# EAGLE design OTArdunioY2 (EAGLE 6.5.0)
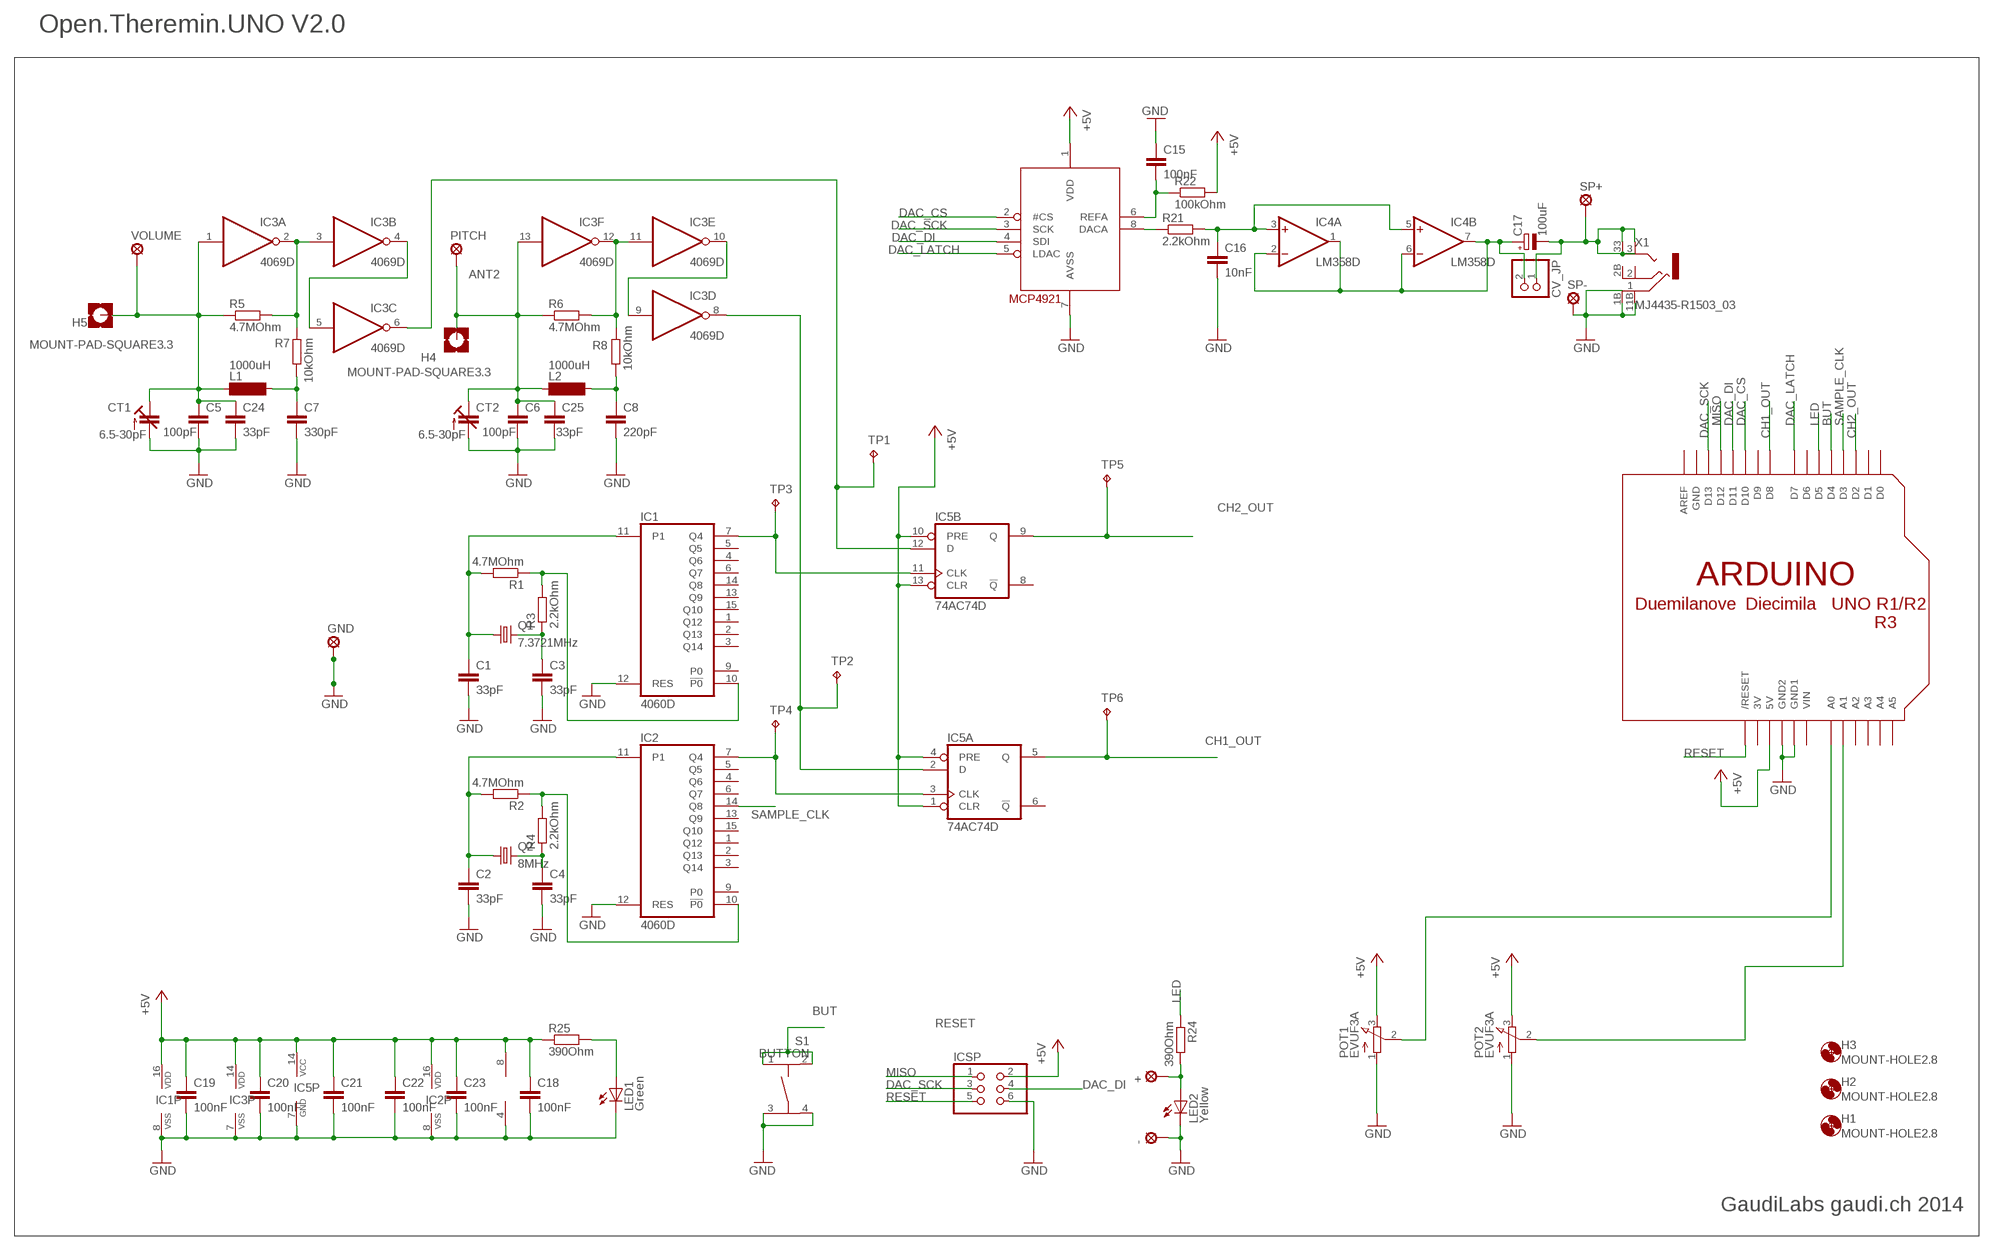
[diagram p0: schematic, sheet 1]

## Parts
+  LSP11  [LSP11]
-  LSP11  [LSP11]
C1  33pF  C-EUC0805  [C0805]
C2  33pF  C-EUC0805  [C0805]
C3  33pF  C-EUC0805  [C0805]
C4  33pF  C-EUC0805  [C0805]
C5  100pF  C-EUC0805  [C0805]
C6  100pF  C-EUC0805  [C0805]
C7  330pF  C-EUC0805  [C0805]
C8  220pF  C-EUC0805  [C0805]
C15  100nF  C-EUC0805  [C0805]
C16  10nF  C-EUC0805  [C0805]
C17  100uF  CPOL-EU153CLV-0505  [153CLV-0505]
C18  100nF  C-EUC0805  [C0805]
C19  100nF  C-EUC0805  [C0805]
C20  100nF  C-EUC0805  [C0805]
C21  100nF  C-EUC0805  [C0805]
C22  100nF  C-EUC0805  [C0805]
C23  100nF  C-EUC0805  [C0805]
C24  33pF  C-EUC0805  [C0805]
C25  33pF  C-EUC0805  [C0805]
CT1  6.5-30pF  C-TRIMMTZBX4  [CTRIMTZBX4]
CT2  6.5-30pF  C-TRIMMTZBX4  [CTRIMTZBX4]
CV_JP  PINHD-1X2  [1X02]
GND  SE14  [SE14]
H1  MOUNT-HOLE2.8  MOUNT-HOLE3.3  [3,3]
H2  MOUNT-HOLE2.8  MOUNT-HOLE3.3  [3,3]
H3  MOUNT-HOLE2.8  MOUNT-HOLE3.3  [3,3]
H4  MOUNT-PAD-SQUARE3.3  [3,3-PAD-SQUARE]
H5  MOUNT-PAD-SQUARE3.3  [3,3-PAD-SQUARE]
IC1  4060D  [SO16]
IC2  4060D  [SO16]
IC3  4069D  [SO14]
IC4  LM358D  [SO08]
IC5  74AC74D  [SO14]
IC6  MCP4921SO8  [SO08]
ICSP  PINHD-2X3  [2X03]
L1  1000uH  MS42  [MS42]
L2  1000uH  MS42  [MS42]
LED1  Green  LEDCHIPLED_0805  [CHIPLED_0805]
LED2  Yellow  LEDCHIPLED_0805  [CHIPLED_0805]
PITCH  SE14  [SE14]
POT1  EVUF3A  [EVUF]
POT2  EVUF3A  [EVUF]
Q1  7.3721MHz  CSM-7X-DU  [CSM-7X-DU]
Q2  8MHz  CSM-7X-DU  [CSM-7X-DU]
R1  4.7MOhm  R-EU_M0805  [M0805]
R2  4.7MOhm  R-EU_M0805  [M0805]
R3  2.2kOhm  R-EU_M0805  [M0805]
R4  2.2kOhm  R-EU_M0805  [M0805]
R5  4.7MOhm  R-EU_M0805  [M0805]
R6  4.7MOhm  R-EU_M0805  [M0805]
R7  10kOhm  R-EU_M0805  [M0805]
R8  10kOhm  R-EU_M0805  [M0805]
R21  2.2kOhm  R-EU_M0805  [M0805]
R22  100kOhm  R-EU_M0805  [M0805]
R24  390Ohm  R-EU_M0805  [M0805]
R25  390Ohm  R-EU_M0805  [M0805]
S1  BUTTON  TASTER-9314_SMD  [TASTER-9314_SMD]
SP+  LSP11  [LSP11]
SP-  LSP11  [LSP11]
TP1  TPTP15R  [TP15R]
TP2  TPTP15R  [TP15R]
TP3  TPTP15R  [TP15R]
TP4  TPTP15R  [TP15R]
TP5  TPTP15R  [TP15R]
TP6  TPTP15R  [TP15R]
U$1  ARDUINODUEMILANOVE-NODIM  ARDUINO-NODIM  [ARDUINO-NODIM]
VOLUME  SE14  [SE14]
X1  MJ4435-R1503_03  [1503_02]

## Nets
+5V: C18.1 C19.1 C20.1 C21.1 C22.1 C23.1 IC1.16(VDD) IC2.16(VDD) IC3.14(P:VDD) IC4.8(P:V+) IC5.1(A:CLR) IC5.4(A:PRE) IC5.10(B:PRE) IC5.13(B:CLR) IC5.14(P:VCC) IC6.1(VDD) ICSP.2 POT1.3(E) POT2.3(E) R22.2 R25.1 U$1.5V
ANT2: C6.1 C25.1 CT2.1(E) H4.B3,3(MOUNT) IC3.13(F:I) L2.1 PITCH.MP R6.1
BUT: S1.1 S1.2 U$1.D4
CH1_OUT: IC5.5(A:Q) TP6.TP U$1.D8
CH2_OUT: IC5.9(B:Q) TP5.TP U$1.D2
DAC_CS: IC6.2(#CS) U$1.D10
DAC_DI: IC6.4(SDI) ICSP.4 U$1.D11
DAC_LATCH: IC6.5(LDAC) U$1.D7
DAC_SCK: IC6.3(SCK) ICSP.3 U$1.D13
GND: -.MP C1.2 C2.2 C3.2 C4.2 C5.2 C6.2 C7.2 C8.2 C15.1 C16.2 C18.2 C19.2 C20.2 C21.2 C22.2 C23.2 C24.2 C25.2 CT1.2(A) CT2.2(A) GND.MP IC1.8(VSS) IC1.12(RES) IC2.8(VSS) IC2.12(RES) IC3.7(P:VSS) IC4.4(P:V-) IC5.7(P:GND) IC6.7(AVSS) ICSP.6 LED1.C LED2.C POT1.1(A) POT2.1(A) S1.3 S1.4 SP-.MP U$1.GND1 U$1.GND2 X1.1(1_1) X1.1B(1_3) X1.11B(1_4)
LED: R24.1 U$1.D5
MISO: ICSP.1 U$1.D12
N$1: C1.1 IC1.11(P1) Q1.1 R1.2
N$2: C17.- CV_JP.1 SP+.MP X1.3(3_1) X1.3B(3_2) X1.33(3_3) X1.33B(3_4)
N$3: IC1.10(!P0) R1.1 R3.2
N$4: POT2.2(S) U$1.A1
N$5: +.MP LED2.A R24.2
N$6: C3.1 Q1.2 R3.1
N$7: C2.1 IC2.11(P1) Q2.1 R2.2
N$8: LED1.A R25.2
N$9: C4.1 Q2.2 R4.1
N$10: IC2.10(!P0) R2.1 R4.2
N$11: C5.1 C24.1 CT1.1(E) H5.B3,3(MOUNT) IC3.1(A:I) L1.1 R5.1 VOLUME.MP
N$12: IC3.6(C:O) IC5.12(B:D) TP1.TP
N$13: C7.1 L1.2 R7.1
N$14: POT1.2(S) U$1.A0
N$16: C17.+ CV_JP.2 IC4.1(A:OUT) IC4.2(A:-IN) IC4.6(B:-IN) IC4.7(B:OUT)
N$17: IC3.8(D:O) IC5.2(A:D) TP2.TP
N$18: C8.1 L2.2 R8.1
N$21: IC1.7(Q4) IC5.11(B:CLK) TP3.TP
N$23: IC2.7(Q4) IC5.3(A:CLK) TP4.TP
N$35: C15.2 IC6.6(REFA) R22.1
N$36: IC6.8(DACA) R21.1
N$37: IC3.11(E:I) IC3.12(F:O) R6.2 R8.2
N$38: IC3.2(A:O) IC3.3(B:I) R5.2 R7.2
N$39: IC3.4(B:O) IC3.5(C:I)
N$40: C16.1 IC4.3(A:+IN) IC4.5(B:+IN) R21.2
N$42: IC3.9(D:I) IC3.10(E:O)
RESET: ICSP.5 U$1.RESET(/RESET)
SAMPLE_CLK: IC2.14(Q8) U$1.D3
Unconnected: IC1.1(Q12) IC1.2(Q13) IC1.3(Q14) IC1.4(Q6) IC1.5(Q5) IC1.6(Q7) IC1.9(P0) IC1.13(Q9) IC1.14(Q8) IC1.15(Q10) IC2.1(Q12) IC2.2(Q13) IC2.3(Q14) IC2.4(Q6) IC2.5(Q5) IC2.6(Q7) IC2.9(P0) IC2.13(Q9) IC2.15(Q10) IC5.6(A:!Q) IC5.8(B:!Q) U$1.A2 U$1.A3 U$1.A4 U$1.A5 U$1.AREF U$1.D0 U$1.D1 U$1.D6 U$1.D9 X1.2(2_1) X1.2B(2_3) X1.11(1_2) X1.22(2_2) X1.22B(2_4)

## Notes on the sheet
- Open.Theremin.UNO V2.0
- RESET
- GaudiLabs gaudi.ch 2014

## Power pins joined to a net without a drawn wire
3V: U$1.3V
GND: U$1.GND
VIN: U$1.VIN

## Library data of the parts
+ - SP+ SP- = solpad:LSP11: SOLDER PAD drill 1.1 mm
C1-C8 C15 C16 C24 C25 = resistor:C-EU: CAPACITOR, European symbol
C17 = resistor:CPOL-EU: POLARIZED CAPACITOR, European symbol
C18-C23 = rcl:C-EU: CAPACITOR, European symbol
CT1 CT2 = resistor:C-TRIMM: Trimm capacitor
CV_JP = pinhead:PINHD-1X2: PIN HEADER
GND PITCH VOLUME = solpad:SE14: SOLDER PAD E1553, drill 1,4mm, distributor Buerklin, 07F820
H1-H3 = holes:MOUNT-HOLE: MOUNTING HOLE with drill center marker
H4 H5 = Gaudi:MOUNT-PAD-SQUARE: MOUNTING PAD, square
IC1 IC2 = Gaudi:4060: 14-stage binary/ripple COUNTER
IC3 = Gaudi:4069: Hex INVERTER
IC4 = Gaudi:LM358: OP AMP also LM158; LM258; LM2904 Source: http://cache.national.com/ds/LM/LM158.pdf
IC5 = 74xx-eu:74*74: Dual D type positive edge triggered FLIP FLOP, preset and clear
IC6 = Gaudi:MCP4921
ICSP = pinhead:PINHD-2X3: PIN HEADER
L1 L2 = Gaudi:MS42: INDUCTOR SMD inductor; OC_FARNELL: unknown; OC_NEWARK: unknown
LED1 LED2 = led:LED: LED OSRAM: - CHIPLED LG R971, LG N971, LY N971, LG Q971, LY Q971, LO R971, LY R971 LH N974, LH R974 LS Q976, LO Q976, LY Q976 LO Q996 - Hyper CHIPLED LW Q18S LB Q993, LB Q99A, LB R99A - SideLED LS A670, LO A670, LY A670, LG A670, LP A670 LB A673, LV A673, LT A673, LW A673 LH A674 LY A675 LS A676, LA A676, LO A676, LY A676, LW A676 LS A679, LY A679, LG A679 - Hyper Micro SIDELED® LS Y876, LA Y876, LO Y876, LY Y876 LT Y87S - SmartLED LW L88C, LW L88S LB L89C, LB L89S, LG L890 LS L89K, LO L89K, LY L89K LS L896, LA L896, LO L896, LY L896 - TOPLED LS T670, LO T670, LY T670, LG T670, LP T670 LSG T670, LSP T670, LSY T670, LOP T670, LYG T670 LG T671, LOG T671, LSG T671 LB T673, LV T673, LT T673, LW T673 LH T674 LS T676, LA T676, LO T676, LY T676, LB T676, LH T676, LSB T676, LW T676 LB T67C, LV T67C, LT T67C, LS T67K, LO T67K, LY T67K, LW E67C LS E67B, LA E67B, LO E67B, LY E67B, LB E67C, LV E67C, LT E67C LW T67C LS T679, LY T679, LG T679 LS T770, LO T770, LY T770, LG T770, LP T770 LB T773, LV T773, LT T773, LW T773 LH T774 LS E675, LA E675, LY E675, LS T675 LS T776, LA T776, LO T776, LY T776, LB T776 LHGB T686 LT T68C, LB T68C - Hyper Mini TOPLED® LB M676 - Mini TOPLED Santana® LG M470 LS M47K, LO M47K, LY M47K Source: http://www.osram.convergy.de LUXEON: - LUMILED® LXK2-PW12-R00, LXK2-PW12-S00, LXK2-PW14-U00, LXK2-PW14-V00 LXK2-PM12-R00, LXK2-PM12-S00, LXK2-PM14-U00 LXK2-PE12-Q00, LXK2-PE12-R00, LXK2-PE12-S00, LXK2-PE14-T00, LXK2-PE14-U00 LXK2-PB12-K00, LXK2-PB12-L00, LXK2-PB12-M00, LXK2-PB14-N00, LXK2-PB14-P00, LXK2-PB14-Q00 LXK2-PR12-L00, LXK2-PR12-M00, LXK2-PR14-Q00, LXK2-PR14-R00 LXK2-PD12-Q00, LXK2-PD12-R00, LXK2-PD12-S00 LXK2-PH12-R00, LXK2-PH12-S00 LXK2-PL12-P00, LXK2-PL12-Q00, LXK2-PL12-R00 Source: www.luxeon.com KINGBRIGHT: KA-3528ASYC Source: www.kingbright.com
POT1 POT2 = Gaudi:EVU: 9 mm Square Rotary Potentiometers Source: Panasonic
Q1 Q2 = Gaudi:CSM-7X-DU: SMD CRYSTAL Source: www.ecsxtal.com .. Crystal 3.6864MHz CSM_7X_DU.PDF; OC_FARNELL: unknown; OC_NEWARK: unknown
R1-R8 R21 R22 R24 R25 = resistor:R-EU_: RESISTOR, European symbol
S1 = Gaudi:TASTER-9314_SMD
TP1-TP6 = testpad:TP: Test pad
U$1 = Gaudi:ARDUINO: Arduino Diecimila/Duemilanove Make a shield with ease, this package has all the named pins as well as the two mounting drill holes and an outline of the USB and DC power connector. The outline is on the DIMENSION layer, so if your board house uses it they will cut the outline to match. http://www.ladyada.net/library/pcb/eaglelibrary.html
X1 = Gaudi:MJ4435-R: Jack connectors according to JISC 6560, 3.5 mm Klinkeneinbaukupplung nach JISC 6560, 3,5 mm, 3-polig/stereo, abgewinkelte Ausführung, Surface-Mount-Technik (SMT) Source: http://www.lumberg.com/Produkte/PDFs/1503_02.pdf

## Board
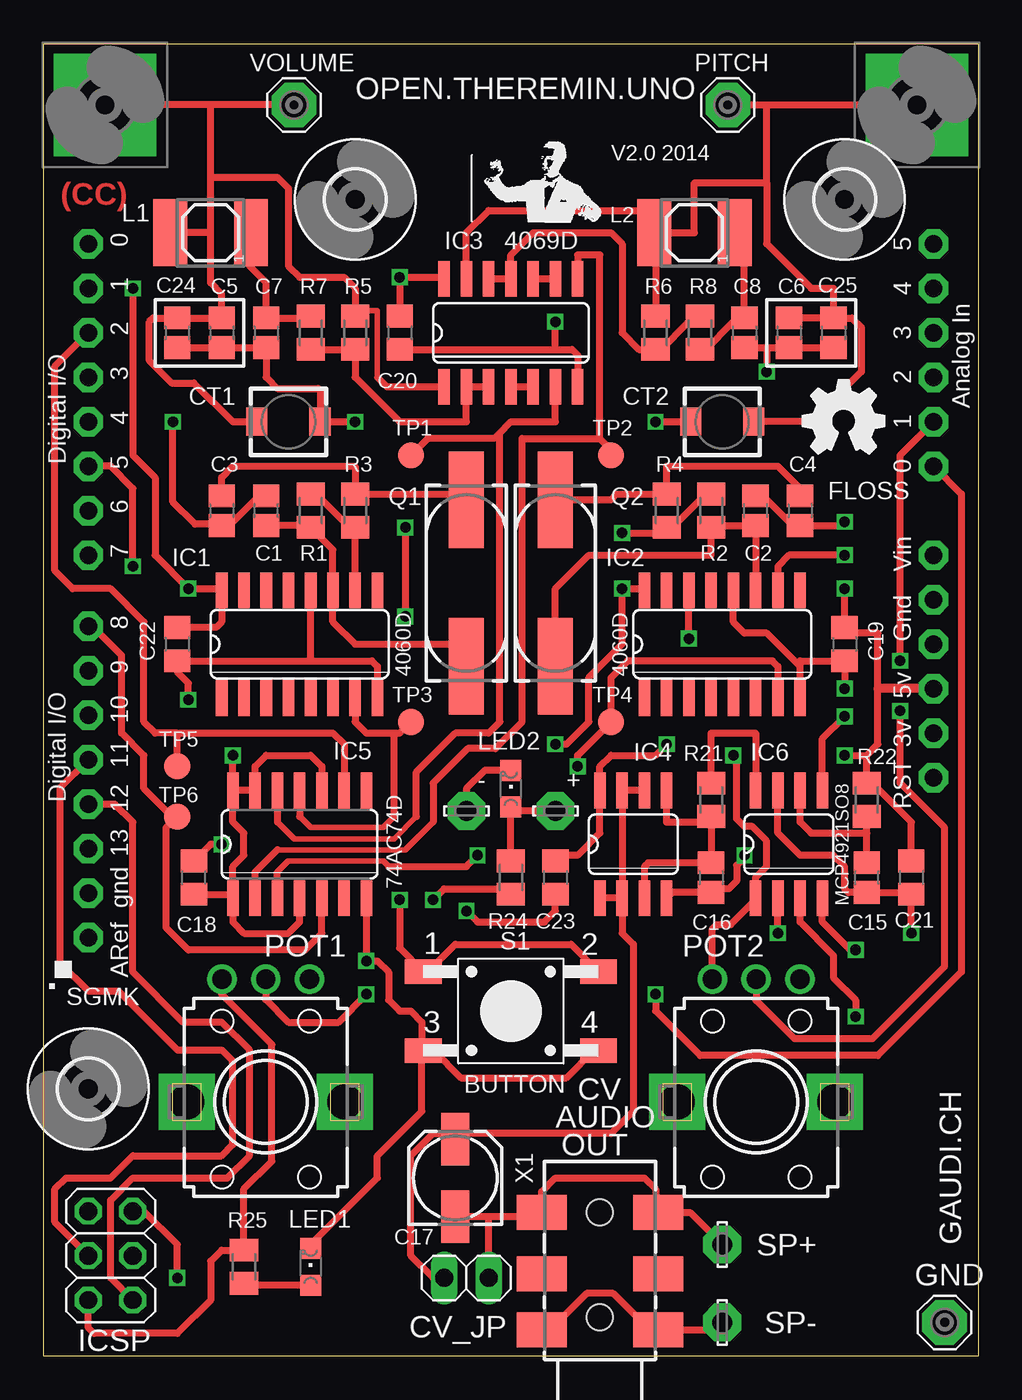
[diagram p1: board, top side]
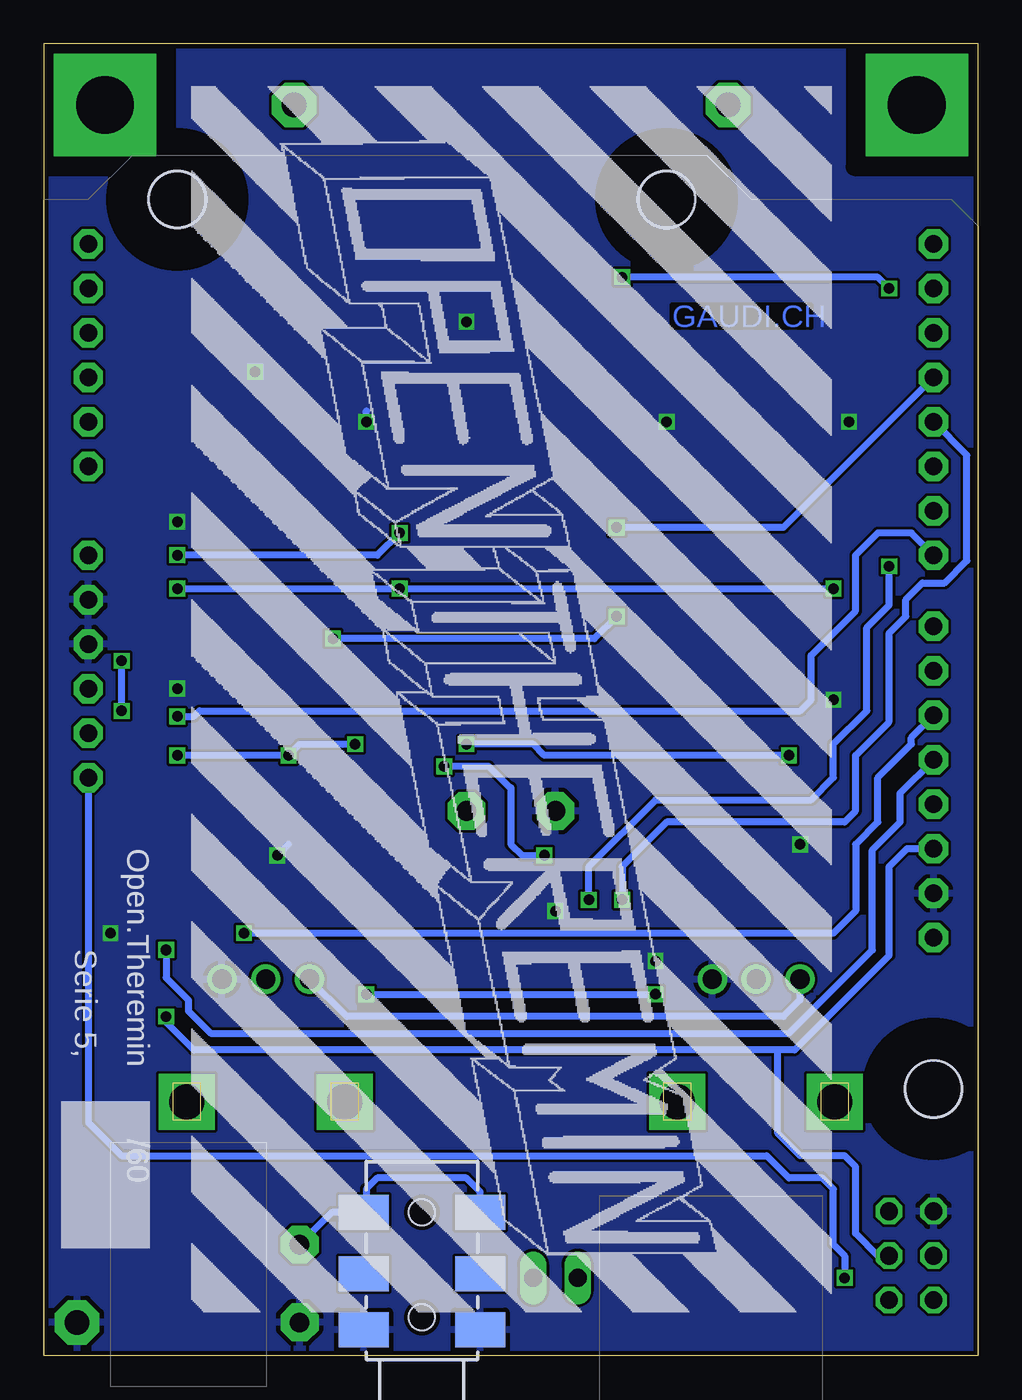
[diagram p2: board, bottom side, seen from below]

Size 53.34 x 74.93 mm. Coordinates in mm from the lower left corner, seen from the top.
Outline: 53.34,74.93 53.34,0 0,0 0,74.93 53.34,74.93
Copper layers (1*2*15*16): Top 0.035mm / dielectric 0.2mm / Route2 0.0175mm / dielectric 1.1mm / Route15 0.0175mm / dielectric 0.2mm / Bottom 0.035mm
Design rules "SeeedStudio_DRU_no_angle_20130527 *": minimum track width 6mil, minimum drill 12mil, track to track 6mil, track to pad 6mil, pad to pad 6mil, via to via 6mil, smd to smd 0mil, copper to edge 10mil, drill to drill 10mil, minimum pad ring 6mil, minimum via ring 6mil, stop-mask expansion 2mil, vias tented up to drill 25mil, thermal gap 10mil

### Footprints (pad centres in the part's own frame; a part is rotated, then mirrored left to right if it is on the bottom)
LSP11 = drill 1.118 pad 2.159 octagon: MP 0,0
C0805 = smd 1.3 x 1.5: 1 -0.85,0; 2 0.85,0
153CLV-0505 = smd 3 x 1.6: + 2.2,0; - -2.2,0
C0805' = smd 1.3 x 1.5: 1 -0.95,0; 2 0.95,0
CTRIMTZBX4 = smd 1.6 x 1.2: 1 0,1.8; 2 0,-1.8
1X02 = drill 1.016 long: 1 -1.27,0; 2 1.27,0
SE14 = drill 1.397 pad 2.54 octagon: MP 0,0
3,3 = hole 3.3: 0,0
3,3-PAD-SQUARE = drill 3.3 pad 5.842 square: B3,3 0,0
SO16 = smd 0.66 x 2.032: 1 -4.445,-3.073; 2 -3.175,-3.073; 3 -1.905,-3.073; 4 -0.635,-3.073; 5 0.635,-3.073; 6 1.905,-3.073; 7 3.175,-3.073; 8 4.445,-3.073; 9 4.445,3.073; 10 3.175,3.073; 11 1.905,3.073; 12 0.635,3.073; 13 -0.635,3.073; 14 -1.905,3.073; 15 -3.175,3.073; 16 -4.445,3.073
SO14 = smd 0.66 x 2.032: 1 -3.81,-3.073; 2 -2.54,-3.073; 3 -1.27,-3.073; 4 0,-3.073; 5 1.27,-3.073; 6 2.54,-3.073; 7 3.81,-3.073; 8 3.81,3.073; 9 2.54,3.073; 10 1.27,3.073; 11 0,3.073; 12 -1.27,3.073; 13 -2.54,3.073; 14 -3.81,3.073
SO08 = smd 0.66 x 2.032: 1 -1.905,-3.073; 2 -0.635,-3.073; 3 0.635,-3.073; 4 1.905,-3.073; 5 1.905,3.073; 6 0.635,3.073; 7 -0.635,3.073; 8 -1.905,3.073
2X03 = drill 1.016 octagon: 1 -2.54,-1.27; 2 -2.54,1.27; 3 0,-1.27; 4 0,1.27; 5 2.54,-1.27; 6 2.54,1.27
MS42 = smd 3.81 x 1.93: 1 0,2.3; 2 0,-2.3
CHIPLED_0805 = smd 1.2 x 1.2: A 0,-1.05; C 0,1.05
EVUF = drill 1.1 pad 1.676: 1 -2.5,-7; 2 0,-7; 3 2.5,-7 | drill 2 pad 3.2 square: M1 4.5,0; M2 -4.5,0
CSM-7X-DU = smd 5.5 x 2: 1 -4.75,0; 2 4.75,0
M0805 = smd 1.3 x 1.6: 1 -0.95,0; 2 0.95,0
TASTER-9314_SMD = smd 2.1 x 1.4: 1 -5,2.25; 2 5,2.25; 3 -5,-2.25; 4 5,-2.25
TP15R = smd 1.5 x 1.5: TP 0,0
ARDUINO-NODIM = drill 1 pad 1.676 octagon: 3V 35.56,2.54; 5V 38.1,2.54; A0 50.8,2.54; A1 53.34,2.54; A2 55.88,2.54; A3 58.42,2.54; A4 60.96,2.54; A5 63.5,2.54; AREF 23.876,50.8; D0 63.5,50.8; D1 60.96,50.8; D2 58.42,50.8; D3 55.88,50.8; D4 53.34,50.8; D5 50.8,50.8; D6 48.26,50.8; D7 45.72,50.8; D8 41.656,50.8; D9 39.116,50.8; D10 36.576,50.8; D11 34.036,50.8; D12 31.496,50.8; D13 28.956,50.8; GND 26.416,50.8; GND1 43.18,2.54; GND2 40.64,2.54; RESET 33.02,2.54; VIN 45.72,2.54 | hole 3.2: 15.24,50.8; 66.04,35.56; 66.04,7.62
1503_02 = smd 2.85 x 2: 1 -3.325,-1.8; 2 -3.325,-5; 3 -3.325,-8.5; 11 3.325,-1.8; 22 3.325,-5; 33 3.325,-8.5 | smd 2.85 x 2 bottom: 1B -3.325,-1.8; 2B -3.325,-5; 3B -3.325,-8.5; 11B 3.325,-1.8; 22B 3.325,-5; 33B 3.325,-8.5 | hole 1.5: 0,-8.5; 0,-2.5

### Placement (x,y rotation side)
+  29.21,31.11 0 top
-  24.13,31.11 0 top
C1  12.7,48.26 90 top
C2  40.64,48.26 90 top
C3  10.16,48.26 270 top
C4  43.18,48.26 270 top
C5  10.16,58.42 270 top
C6  42.55,58.42 270 top
C7  12.7,58.42 270 top
C8  40.01,58.42 270 top
C15  46.99,27.3 90 top
C16  38.1,27.3 270 top
C17  23.5,10.16 90 top
C18  100nF  [C0805']  8.57,27.3 90 top
C19  100nF  [C0805']  45.72,40.64 270 top
C20  100nF  [C0805']  20.32,58.42 270 top
C21  100nF  [C0805']  49.53,27.3 270 top
C22  100nF  [C0805']  7.62,40.64 270 top
C23  100nF  [C0805']  29.21,27.3 270 top
C24  7.62,58.42 270 top
C25  45.09,58.42 270 top
CT1  13.97,53.34 90 top
CT2  38.73,53.34 270 top
CV_JP  24.13,4.45 180 top
GND  51.44,1.91 0 top
H1  2.54,15.24 0 top
H2  45.72,66.04 0 top
H3  17.78,66.04 0 top
H4  49.85,71.44 0 top
H5  3.49,71.44 0 top
IC1  14.61,40.64 0 top
IC2  38.73,40.64 0 top
IC3  26.67,58.42 0 top
IC4  33.66,29.21 0 top
IC5  14.61,29.21 0 top
IC6  42.55,29.21 0 top
ICSP  3.81,5.71 90 top
L1  9.53,64.14 90 top
L2  37.15,64.14 90 top
LED1  15.24,5.08 0 top
LED2  26.67,32.38 0 top
PITCH  39.05,71.44 0 top
POT1  12.67,14.5 180 top
POT2  40.67,14.5 180 top
Q1  24.13,44.13 90 top
Q2  29.21,44.13 90 top
R1  15.24,48.26 270 top
R2  38.1,48.26 270 top
R3  17.78,48.26 270 top
R4  35.56,48.26 270 top
R5  17.78,58.42 270 top
R6  34.92,58.42 270 top
R7  15.24,58.42 270 top
R8  37.47,58.42 90 top
R21  38.1,31.75 270 top
R22  46.99,31.75 90 top
R24  26.67,27.3 90 top
R25  11.43,5.08 270 top
S1  26.67,19.68 0 top
SP+  38.73,6.35 90 top
SP-  38.73,1.91 90 top
TP1  20.95,51.44 0 top
TP2  32.38,51.44 0 top
TP3  20.95,36.2 0 top
TP4  32.38,36.2 0 top
TP5  7.62,33.66 0 top
TP6  7.62,30.8 0 top
U$1  53.34,0 90 top
VOLUME  14.29,71.44 0 top
X1  31.75,-0.32 180 top

### Tracks (layer width: path | path; a pad name or v marks a point on that pad's centre or on a via)
+5V  (via drill 0.6)
  Top 0.406: C22.1 9.84,41.59 10.16,41.91 IC1.16 10.06,43.81 v8.26,43.81 6.35,45.72 6.35,50.16 5.08,51.44 v5.08,60.96 | C19.1 46.03,41.27 47.62,41.27 47.62,38.1 47.62,34.92 46.99,34.29 | C19.1 45.72,41.27 | C19.1 v45.72,43.81 | IC2.16 34.19,43.81 v33.02,43.81 33.02,40.64 31.11,38.73 31.11,36.2 29.84,34.92 v29.21,34.92 | IC5.14 IC5.13 12.06,33.66 12.7,34.29 15.24,34.29 15.88,33.66 IC5.10 | 46.99,34.29 R22.2 47.3,32.38 47.62,32.38 49.53,30.48 C21.1 49.21,28.25 | IC5.1 10.79,24.77 11.43,24.13 13.97,24.13 14.61,24.77 IC5.4 | IC3.14 22.76,61.59 v20.32,61.59 C20.1 | v39.37,34.29 39.56,34.1 39.56,30.67 40.01,30.23 40.45,30.23 41.27,29.4 41.27,27.94 40.64,27.3 IC6.1 40.54,26.04 40.54,25.93 39.23,24.62 38.42,24.62 38.17,24.38 POT2.3 | IC5.1 10.79,27.94 11.43,28.57 11.43,29.84 10.79,30.48 IC5.14 | IC5.14 v10.79,34.29 | C18.1 10.58,26.36 IC5.1 | R25.1 | ICSP.2 2.54,1.59 2.86,1.27 7.62,1.27 9.53,3.17 9.53,5.4 10.16,6.03 R25.1 | R25.1 11.43,9.53 13.02,11.11 13.02,17.78 10.16,20.64 POT1.3 | v45.72,34.29 46.99,34.29 | C23.1 29.53,28.57 30.48,28.57 31.75,29.84 IC4.8 31.75,33.66 32.38,34.29 34.92,34.29 v35.56,34.92
  Top 0.508: U$1.5V 47.62,38.1
  Bottom 0.406: v45.72,43.81 v33.02,43.81 v8.26,43.81 | v10.79,34.29 24.77,34.29 25.4,34.92 v29.21,34.92 | v5.08,60.96 5.71,61.59 v20.32,61.59 | v45.72,34.29 v39.37,34.29 38.73,34.92 v35.56,34.92 | POT1.3 10.17,20.31 11.11,19.37 36.04,19.37 POT2.3
ANT2
  Top 0.406: L2.1 34.29,64.14 | 34.92,64.14 L2.1 | 34.92,64.14 R6.1 | L2.1 37.15,64.14 37.15,66.99 41.27,66.99 | CT2.1 43.81,53.34 46.67,56.2 46.67,58.74 46.14,59.27 C25.1 | 41.27,66.99 41.27,63.5 43.81,60.96 45.09,60.96 C25.1 | IC3.13 24.13,64.14 25.4,65.41 34.92,65.41 34.92,64.14 | PITCH.MP 41.27,71.44 | 41.27,71.44 H4.B3,3 | C25.1 C6.1 | 41.27,66.99 41.27,71.44
BUT  (via drill 0.6)
  Top 0.406: S1.2 30.11,23.5 23.5,23.5 21.93,21.93 S1.1 20.32,23.29 v20.32,26.04
  Bottom 0.406: U$1.D4 0.64,51.44 0.64,45.4 1.91,44.13 3.17,44.13 4.13,43.18 4.13,42.23 5.08,41.27 5.08,36.2 6.99,34.29 6.99,31.11 7.62,30.48 17.78,30.48 20.32,27.94 v20.32,26.04
CH1_OUT
  Top 0.406: 15.88,26.04 IC5.5 15.88,24.13 14.92,23.18 8.26,23.18 6.99,24.45 6.99,30.16 TP6.TP 7.62,31.11 6.99,31.11 5.71,32.38 5.71,34.29 4.45,35.56 4.45,40.01 2.79,41.66 U$1.D8
CH2_OUT
  Top 0.406: U$1.D2 0.64,56.52 0.64,44.83 1.65,43.81 3.81,43.81 5.71,41.91 5.71,36.2 6.35,35.56 7.62,35.56 | TP5.TP 7.62,35.56 | 7.62,35.56 16.51,35.56 17.14,34.92 IC5.9
DAC_CS  (via drill 0.6)
  Top 0.406: v41.91,24.13 IC6.2
  Bottom 0.406: U$1.D10 3.81,35.31 3.81,34.92 5.71,33.02 5.71,30.48 6.99,29.21 6.99,25.4 8.26,24.13 v41.91,24.13
DAC_DI  (via drill 0.6)
  Top 0.406: ICSP.4 0.64,7.62 0.64,9.53 1.27,10.16 3.81,10.16 5.08,11.43 10.16,11.43 10.79,12.06 10.79,16.83 10.16,17.46 7.62,17.46 4.25,20.83 2.54,20.83 0.95,22.42 0.95,32.45 U$1.D11 | v46.35,23.18 46.04,23.18 44.45,24.77 IC6.4
  Bottom 0.406: U$1.D11 4.45,32.13 4.45,30.48 6.03,28.89 6.03,23.18 10.79,18.41 43.81,18.41 45.09,19.68 45.09,20.32 46.35,21.59 v46.35,23.18
DAC_LATCH  (via drill 0.6)
  Top 0.406: IC6.5 44.45,35.24 v45.72,36.51
  Bottom 0.406: U$1.D7 3.81,46.99 5.71,46.99 6.99,45.72 6.99,42.55 9.53,40.01 9.53,37.47 10.16,36.83 44.45,36.83 44.77,36.51 v45.72,36.51
DAC_SCK  (via drill 0.6)
  Top 0.406: IC6.3 43.18,24.77 45.09,22.86 45.09,21.59 46.35,20.32 v46.35,19.37
  Bottom 0.406: U$1.D13 4.06,28.96 5.08,27.94 5.08,22.86 10.48,17.46 11.43,17.46 | ICSP.3 5.71,5.71 6.99,6.99 6.99,10.79 7.62,11.43 10.16,11.43 11.43,12.7 11.43,17.46 | v46.35,19.37 46.35,19.05 44.77,17.46 11.43,17.46
GND  (via drill 0.6)
  Top 0.406: 29.21,57.47 30.16,57.47 30.48,57.15 IC3.7 | C1.2 12.28,49.11 10.79,47.62 10.38,47.62 C3.2 10.07,47.5 8.64,47.5 7.37,48.77 v7.37,53.34 | C2.2 40.85,48.9 41.27,48.9 42.76,47.41 C4.2 45.51,47.41 v45.72,47.62 | 15.24,39.69 C22.2 7.62,39.05 8.26,38.42 v8.26,37.47 | 15.24,39.69 18.73,39.69 19.05,39.37 IC1.8 19.15,37.47 | 15.24,39.69 IC1.12 | IC2.8 43.18,39.37 | 43.18,39.37 43.18,39.69 C19.2 v45.72,38.1 | 39.37,43.81 IC2.12 39.37,41.91 40.01,41.27 41.27,41.27 43.18,39.37 | 29.21,57.47 v29.21,59.05 | v17.78,53.34 CT1.2 15.77,55.14 15.66,55.24 13.34,55.24 12.7,55.88 C7.2 C5.2 C24.2 | v34.92,53.34 CT2.2 | 41.27,57.57 C6.2 | 41.27,57.57 C8.2 C25.2 | C20.2 29.21,57.47 | S1.3 22.25,17.43 23.81,15.88 29.84,15.88 31.43,17.46 31.75,17.46 31.72,17.43 S1.4 | 41.27,57.57 v41.27,56.2 | IC6.7 41.91,29.84 43.18,28.57 45.09,28.57 45.72,27.94 45.72,26.67 45.94,26.45 C15.1 49.43,26.45 C21.2 v49.53,24.13 | C16.2 35.88,26.45 IC4.4 | LED1.C 15.24,6.35 19.05,10.16 19.05,11.43 21.59,13.97 21.59,17.36 S1.3 | X1.1B 35.35,1.48 | X1.1B 38.31,1.48 SP-.MP | LED2.C 25.18,33.44 24.13,32.38 -.MP | C16.2 38.52,26.45 | v40.01,28.57 40.01,28.45 39.56,28 39.56,27.11 39.12,26.67 38.31,26.67 C16.2 | 29.21,26.04 C23.2 29.21,25.4 28.57,24.77 24.77,24.77 v24.13,25.4 | v10.16,29.21 9.53,29.21 C18.2 | S1.3 21.59,17.52 21.59,19.05 20.95,19.68 20.32,19.68 19.68,20.32 19.68,21.91 19.05,22.54 v18.41,22.54 IC5.7 | X1.1B 35.08,1.5 | X1.1B 34.59,1.48 32.51,3.56 30.99,3.56 28.96,1.52
  Bottom 0.406: v34.92,53.34 34.92,53.98 | v41.27,56.2 41.27,56.3 | 35.5,1.91 X1.1B | v40.01,28.57 39.37,29.21
  pour Bottom: 0,74.93 0,0 53.34,0 53.34,74.93
LED  (via drill 0.6)
  Top 0.406: v5.08,45.09 5.08,49.53 3.81,50.8 U$1.D5 | v22.23,26.04 22.86,26.67 26.67,26.67 | 26.67,26.67 26.99,26.67 | R24.1 26.67,26.67
  Bottom 0.406: v5.08,45.09 5.08,42.86 6.35,41.59 6.35,36.83 8.26,34.92 8.26,33.02 9.53,31.75 18.41,31.75 22.23,27.94 v22.23,26.04
MISO
  Top 0.406: ICSP.1 3.81,4.45 3.81,8.89 5.08,10.16 10.48,10.16 11.75,11.43 11.75,17.46 10.16,19.05 7.94,19.05 5.08,21.91 5.08,30.48 4.06,31.5 U$1.D12
N$1
  Top 0.406: C1.1 15.14,47.41 R1.2 16.51,46.04 IC1.11 16.51,41.91 17.78,40.64 24.13,40.64 | 24.13,40.64 Q1.1 | 24.13,40.64 24.13,41.27
N$2
  Top 0.406: C17.- 25.4,7.96 | CV_JP.1 25.4,7.96 | 28.43,7.96 X1.33B | 25.4,7.96 28.2,7.96 X1.33B | X1.33B 28.43,9.38 29.21,10.16 34.29,10.16 34.92,9.53 34.92,8.33 X1.3B 36.9,8.18 SP+.MP
  Bottom 0.406: X1.33B 28.43,9.38 29.21,10.16 34.29,10.16 34.92,9.53 34.92,8.33 X1.3B 36.9,8.18 SP+.MP
N$3
  Top 0.406: IC1.10 R3.2 17.46,47.31 15.88,48.9 15.55,48.9 R1.1
N$4  (via drill 0.6)
  Top 0.406: POT2.2 40.67,20.29 42.86,18.1 47.31,18.1 51.44,22.23 51.44,30.16 48.9,32.7 v48.9,36.83 | v48.9,39.69 48.9,51.44 U$1.A1
  Bottom 0.406: v48.9,36.83 v48.9,39.69
N$5
  Top 0.406: R24.2 LED2.A 26.89,31.11 +.MP
N$6
  Top 0.406: C3.1 10.16,50.16 10.79,50.8 17.78,50.8 R3.1 23.8,49.21 Q1.2
N$7
  Top 0.406: IC2.11 C2.1 38.2,47.41 R2.2 38.1,45.72 31.11,45.72 29.21,43.81 Q2.1
N$8
  Top 0.406: LED1.A 11.53,4.03 R25.2
N$9
  Top 0.406: C4.1 43.18,49.53 41.91,50.8 35.56,50.8 R4.1 32.69,49.2 32.38,48.9 29.22,48.9 Q2.2
N$10  (via drill 0.6)
  Top 0.406: R2.1 37.78,49.21 36.2,47.62 35.88,47.62 R4.2 35.24,46.99 v33.02,46.99 | IC2.10 41.91,45.09 42.55,45.72 v45.72,45.72
  Bottom 0.406: v45.72,45.72 34.29,45.72 v33.02,46.99
N$11
  Top 0.305: 18.1,59.69 19.05,59.69 19.05,55.88
  Top 0.406: C5.1 10.16,59.69 | C5.1 10.16,60.64 9.53,61.28 9.53,64.14 | 9.53,64.14 L1.1 | 9.53,64.14 9.53,67.31 | VOLUME.MP 9.53,71.44 | 9.53,71.44 H5.B3,3 | R5.1 18.1,59.37 | R5.1 17.78,60.96 17.14,61.59 14.61,61.59 13.97,62.23 13.97,66.67 13.34,67.31 9.53,67.31 | CT1.1 10.79,53.34 8.57,55.56 7.3,55.56 6.03,56.83 6.03,59.05 6.25,59.27 C24.1 C5.1 | R5.1 18.1,59.69 | IC3.1 19.58,55.35 19.05,55.88 | 9.53,67.31 9.53,71.44
N$12
  Top 0.305: 13.34,30.48 14.29,29.53 20,29.53 21.27,30.8
  Top 0.406: 26.04,52.7 26.04,36.2 25.4,35.56 23.5,35.56 21.27,33.34 21.27,30.8 | 26.04,52.7 26.67,53.34 29.21,53.34 IC3.6 | TP1.TP 21.91,52.39 25.72,52.39 26.04,52.7 | IC5.12 13.34,30.48
N$13
  Top 0.406: R7.1 15.14,59.27 C7.1 12.7,61.28 11.75,62.23 11.75,64.06 L1.2
N$14  (via drill 0.6)
  Top 0.406: U$1.A0 52.39,49.21 52.39,21.91 47.62,17.14 37.47,17.14 34.92,19.68 v34.92,20.64 | POT1.2 12.67,20.35 13.97,19.05 16.83,19.05 v18.41,20.64
  Bottom 0.406: v34.92,20.64 v18.41,20.64
N$16
  Top 0.406: C17.+ 23.5,12.06 | IC4.6 IC4.7 IC4.2 | IC4.2 IC4.1 | IC4.2 33.02,24.13 33.66,23.5 33.66,13.97 32.38,12.7 23.84,12.7 C17.+ | CV_JP.2 22.23,4.45 20.95,5.71 20.95,11.43 22.23,12.7 23.16,12.7 C17.+
N$17
  Top 0.305: 13.34,28.89 20.64,28.89 22.23,30.48
  Top 0.406: IC3.8 30.48,62.87 31.75,62.87 31.75,52.39 | 31.75,52.39 27.3,52.39 27.3,36.2 25.78,34.67 24.19,34.67 22.23,32.7 22.23,30.48 | TP2.TP 32.38,51.75 31.75,52.39 | IC5.2 12.06,27.62 13.34,28.89
N$18
  Top 0.406: L2.2 40.01,63.58 C8.1 39.79,59.05 39.37,59.05 37.78,57.47 R8.1
N$21
  Top 0.305: 14.61,30.8 15.24,30.16 19.37,30.16 20,30.8
  Top 0.406: TP3.TP 20.32,35.56 20,35.56 | IC1.7 17.78,36.2 18.41,35.56 20,35.56 | IC5.11 14.61,30.8 | 20,30.8 20,35.56
N$23  (via drill 0.6)
  Top 0.305: 13.34,27.62 13.97,28.26 19.37,28.26 19.68,27.94
  Top 0.406: IC2.7 41.91,39.37 41.59,39.69 33.34,39.69 32.38,38.73 TP4.TP 30.48,34.29 v30.48,33.66 | IC5.3 13.34,27.62 | 19.68,27.94 24.13,27.94 v24.77,28.57
  Bottom 0.406: v30.48,33.66 27.94,33.66 26.73,32.45 26.67,32.45 26.67,29.21 26.04,28.57 v24.77,28.57
N$35
  Top 0.406: C15.2 46.99,29.84 | 46.99,29.84 R22.1 | IC6.6 43.18,30.48 43.81,29.84 46.99,29.84
N$36
  Top 0.406: R21.1 38.1,35.56 40.64,35.56 IC6.8
N$37
  Top 0.406: IC3.12 IC3.11 26.67,62.87 27.94,64.14 32.38,64.14 33.02,63.5 33.02,58.42 33.97,57.47 R6.2 35.24,57.47 36.83,59.05 37.15,59.05 R8.2
N$38
  Top 0.406: IC3.3 IC3.2 24.13,53.34 20.32,53.34 17.78,55.88 R5.2 R7.2
N$39
  Top 0.406: IC3.4 IC3.5
N$40
  Top 0.406: IC4.5 35.56,30.48 37.78,30.48 R21.2 C16.1 34.51,28.16 34.29,27.94 IC4.3
N$42
  Top 0.406: IC3.9 IC3.10
RESET  (via drill 0.6)
  Top 0.406: v7.62,4.45 7.62,6.35 5.71,8.26 ICSP.5
  Bottom 0.406: v7.62,4.45 7.62,5.71 8.26,6.35 8.26,9.53 8.89,10.16 10.79,10.16 12.06,11.43 48.9,11.43 50.8,13.34 U$1.RESET
SAMPLE_CLK  (via drill 0.6)
  Top 0.406: v36.83,40.96 IC2.14 | v20.64,47.31 v20.64,42.23
  Bottom 0.406: v36.83,40.96 21.91,40.96 v20.64,42.23 | v20.64,47.31 11.11,47.31 U$1.D3

### Text on the board
Top: (CC)
Bottom: GAUDI.CH
tNames: OPEN.THEREMIN.UNO | V2.0 2014 | FLOSS | SGMK | CV | AUDIO | OUT | GAUDI.CH
bNames: Open.Theremin /60 | Serie 5,